# Altium project 测频.PrjPCB
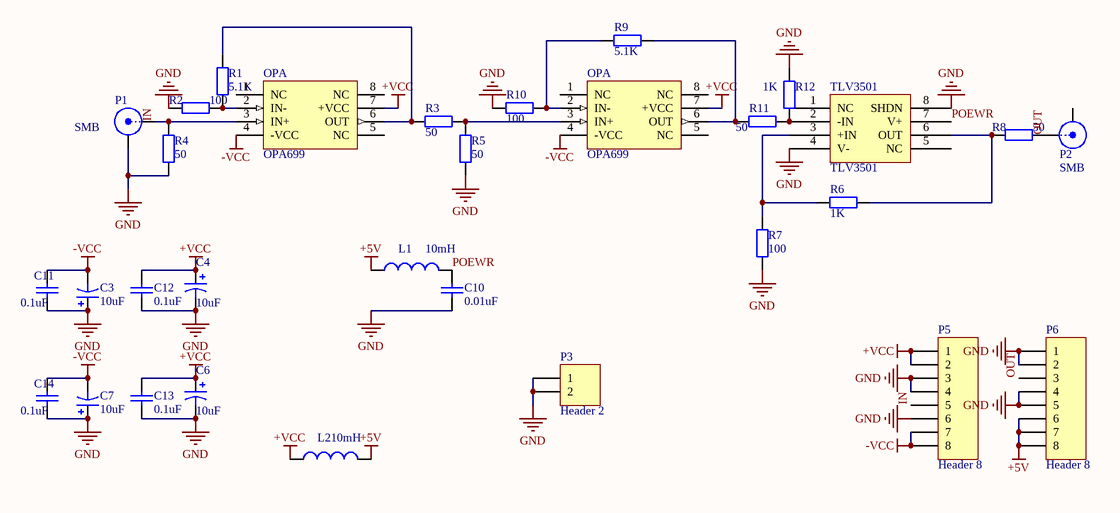
[diagram p0: 测频.SchDoc]
1 sheet, 31 parts. Net scope: global (net labels, ports and power ports of the same name join across sheets).
Board file: 测频.PcbDoc

## Sheet 测频.SchDoc
size A4

### Parts
(Parts that share a designator on the sheet are numbered #1, #2 ... from top to bottom, then left to right.)
C3  value 10uF  [CAPC3216[1206]S]  (hidden comment: Cap Pol1)
C4  value 10uF  [CAPC3216[1206]S]  (hidden comment: Cap Pol1)
C6  value 10uF  [CAPC3216[1206]S]  (hidden comment: Cap Pol1)
C7  value 10uF  [CAPC3216[1206]S]  (hidden comment: Cap Pol1)
C10  value 0.01uF  [A-0805]  (hidden comment: Cap)
C11  value 0.1uF  [A-0805]  (hidden comment: Cap)
C12  value 0.1uF  [A-0805]  (hidden comment: Cap)
C13  value 0.1uF  [A-0805]  (hidden comment: Cap)
C14  value 0.1uF  [A-0805]  (hidden comment: Cap)
L1  value 10mH  [A-0805]  (hidden comment: Inductor)
L2  value 10mH  [A-0805]  (hidden comment: Inductor)
OPA#1  OPA699  [D008_L]
OPA#2  OPA699  [D008_L]
P1  SMB  [SMB_V-RJ45]
P2  SMB  [SMB_V-RJ45]
P3  Header 2  [HDR1X2]
P5  Header 8  [HDR1X8]
P6  Header 8  [HDR1X8]
R1  value 5.1K  [A-0805]  (hidden comment: Res2)
R2  value 100  [A-0805]  (hidden comment: Res2)
R3  value 50  [A-0805]  (hidden comment: Res2)
R4  value 50  [A-0805]  (hidden comment: Res2)
R5  value 50  [A-0805]  (hidden comment: Res2)
R6  value 1K  [A-0805]  (hidden comment: Res2)
R7  value 100  [A-0805]  (hidden comment: Res2)
R8  value 50  [A-0805]  (hidden comment: Res2)
R9  value 5.1K  [A-0805]  (hidden comment: Res2)
R10  value 100  [A-0805]  (hidden comment: Res2)
R11  value 50  [A-0805]  (hidden comment: Res2)
R12  value 1K  [A-0805]  (hidden comment: Res2)
TLV3501  TLV3501  [D008_L]

### Nets
+5V: L1.1 L2.2 P6.6 P6.7 P6.8
+VCC: C4.1 C6.1 C12.2 C13.2 L2.1 OPA#1.7(+VCC) OPA#2.7(+VCC) P5.1 P5.2
-VCC: C3.2 C7.2 C11.2 C14.2 OPA#1.4(-VCC) OPA#2.4(-VCC) P5.7 P5.8
GND: C3.1 C4.2 C6.2 C7.1 C10.1 C11.1 C12.1 C13.1 C14.1 P1.2(Y) P3.1 P3.2 P5.3 P5.4 P5.6 P6.1 P6.2 P6.4 P6.5 R2.1 R4.1 R5.1 R7.1 R10.2 R12.2 TLV3501.4(V-) TLV3501.8(SHDN)
IN: OPA#1.3(IN+) P1.1(X) P5.5 R4.2
OUT: P2.1(X) P6.3 R8.2
POEWR: C10.2 L1.2 TLV3501.7(V+)
NetOPA#1_2: OPA#1.2(IN-) R1.1 R2.2
NetOPA#1_6: OPA#1.6(OUT) R1.2 R3.1
NetOPA#2_2: OPA#2.2(IN-) R9.2 R10.1
NetOPA#2_3: OPA#2.3(IN+) R3.2 R5.2
NetOPA#2_6: OPA#2.6(OUT) R9.1 R11.1
NetR6_1: R6.1 R8.1 TLV3501.6(OUT)
NetR6_2: R6.2 R7.2 TLV3501.3(+IN)
NetR11_2: R11.2 R12.1 TLV3501.2(-IN)

Not connected (* = marked no-connect by the designer): OPA#1 1(NC) 5(NC) 8(NC); OPA#2 1(NC) 5(NC) 8(NC); P2 2(Y); TLV3501 1(NC) 5(NC)

### Library data of the parts
C3 C4 C6 C7 = Cap Pol1: Polarized Capacitor (Radial); Published: 8-Jun-2000; LatestRevisionDate: 17-Jul-2002; LatestRevisionNote: Re-released for DXP Platform.; PackageReference: RB7.6-15; Publisher: Altium Limited; PackageDescription: Polarized Capacitor (Radial); 2 Leads
C10-C14 = Cap: Capacitor; Published: 8-Jun-2000; LatestRevisionDate: 17-Jul-2002; LatestRevisionNote: Re-released for DXP Platform.; PackageReference: RAD-0.3; Publisher: Altium Limited; PackageDescription: Radial Cap, Thru-Hole; 2 Leads; 0.3 in Pin Spacing
L1 L2 = Inductor: Code_IEC: 1005; Published: 8-Jun-2000; LatestRevisionDate: 29-May-2009; LatestRevisionNote: IPC-7351 Footprint Added.; PackageReference: 0402-A; Publisher: Altium Limited; PackageDescription: Chip Inductor; Code_JEITA: 0402
OPA#1 OPA#2 = OPA690
P1 P2 = SMB: SMB Straight Connector; LatestRevisionDate: 17-Jul-2002; LatestRevisionNote: Re-released for DXP Platform.; Publisher: Altium Limited
P3 = Header 2: Header, 2-Pin; LatestRevisionDate: 17-Jul-2002; LatestRevisionNote: Re-released for DXP Platform.; Publisher: Altium Limited
P5 P6 = Header 8: Header, 8-Pin; LatestRevisionDate: 17-Jul-2002; LatestRevisionNote: Re-released for DXP Platform.; Publisher: Altium Limited
R1-R12 = Res2: Resistor; Published: 8-Jun-2000; LatestRevisionDate: 17-Jul-2002; LatestRevisionNote: Re-released for DXP Platform.; PackageReference: AXIAL-0.4; Publisher: Altium Limited; PackageDescription: Axial Device, Thru-Hole; 2 Leads; 0.4 in Pin Spacing